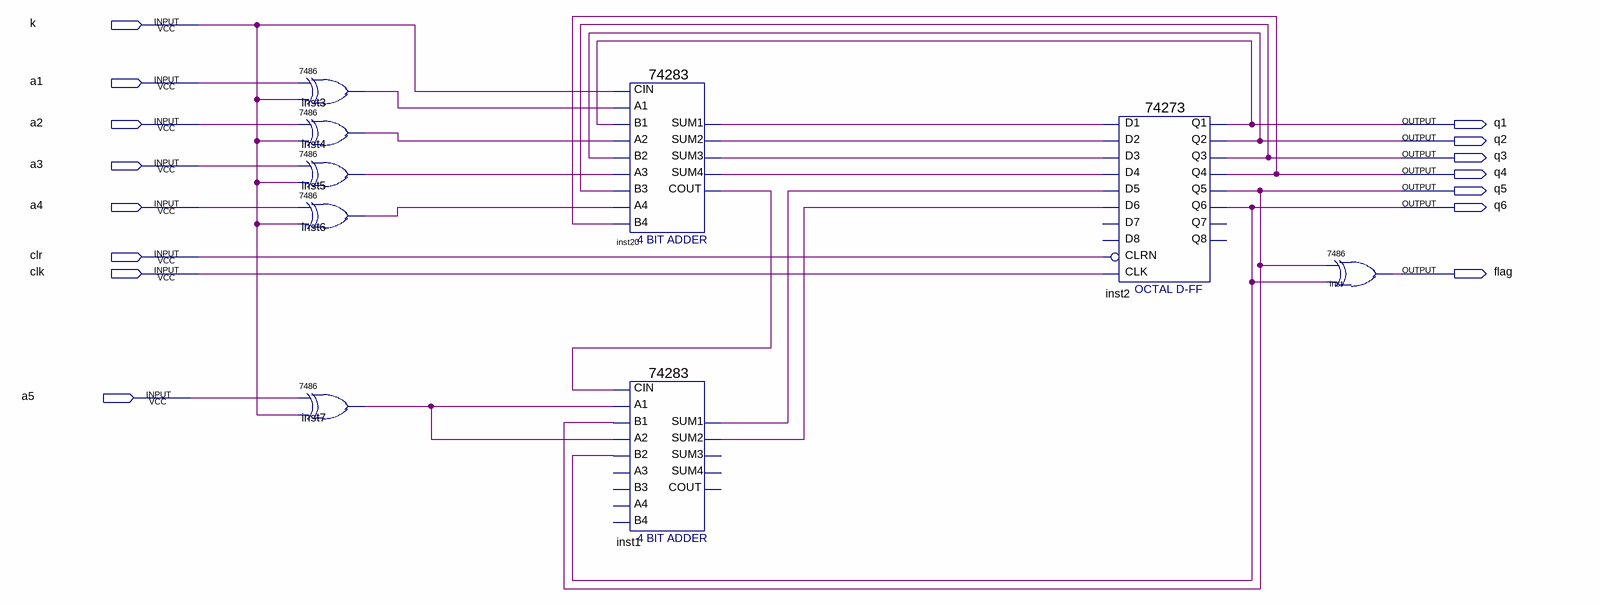
[diagram p0: schematic sheet]
// Quartus schematic 10.bdf as structural Verilog: 9 symbols, 15 pins
module \10  (
  input  k,
  input  a1,
  input  a2,
  input  a3,
  input  a4,
  input  clr,
  input  clk,
  input  a5,
  output q1,
  output q2,
  output q3,
  output q4,
  output q5,
  output q6,
  output flag
);

  wire inst1_sum1, inst1_sum2, inst3_1, inst4_1, inst5_1, inst6_1, inst7_1, inst20_cout, inst20_sum1,
       inst20_sum2, inst20_sum3, inst20_sum4;

  \7486  inst3 (.\2 (a1), .\3 (k), .\1 (inst3_1));
  \7486  inst4 (.\2 (a2), .\3 (k), .\1 (inst4_1));
  \7486  inst5 (.\2 (a3), .\3 (k), .\1 (inst5_1));
  \7486  inst6 (.\2 (a4), .\3 (k), .\1 (inst6_1));
  \7486  inst7 (.\2 (a5), .\3 (k), .\1 (inst7_1));
  \74283  inst20 (
    .CIN(k), .A1(inst3_1), .A2(inst4_1), .B2(q2), .A3(inst5_1), .A4(inst6_1), .B4(q4), .B1(q1), .B3(q3),
    .SUM4(inst20_sum4), .COUT(inst20_cout), .SUM1(inst20_sum1), .SUM2(inst20_sum2), .SUM3(inst20_sum3));
  \74283  inst1 (
    .CIN(inst20_cout), .A1(inst7_1), .A2(inst7_1), .B2(q6), .B1(q5), .SUM1(inst1_sum1), .SUM2(inst1_sum2));  // open: A3, A4, B4, B3, SUM4, COUT, SUM3
  \74273  inst2 (
    .D2(inst20_sum2), .D3(inst20_sum3), .D1(inst20_sum1), .D4(inst20_sum4), .D6(inst1_sum2), .D5(inst1_sum1),
    .CLK(clk), .CLRN(clr), .Q4(q4), .Q1(q1), .Q2(q2), .Q3(q3), .Q6(q6), .Q5(q5));  // open: D7, D8, Q7, Q8
  \7486  inst (.\2 (q5), .\3 (q6), .\1 (flag));
endmodule
